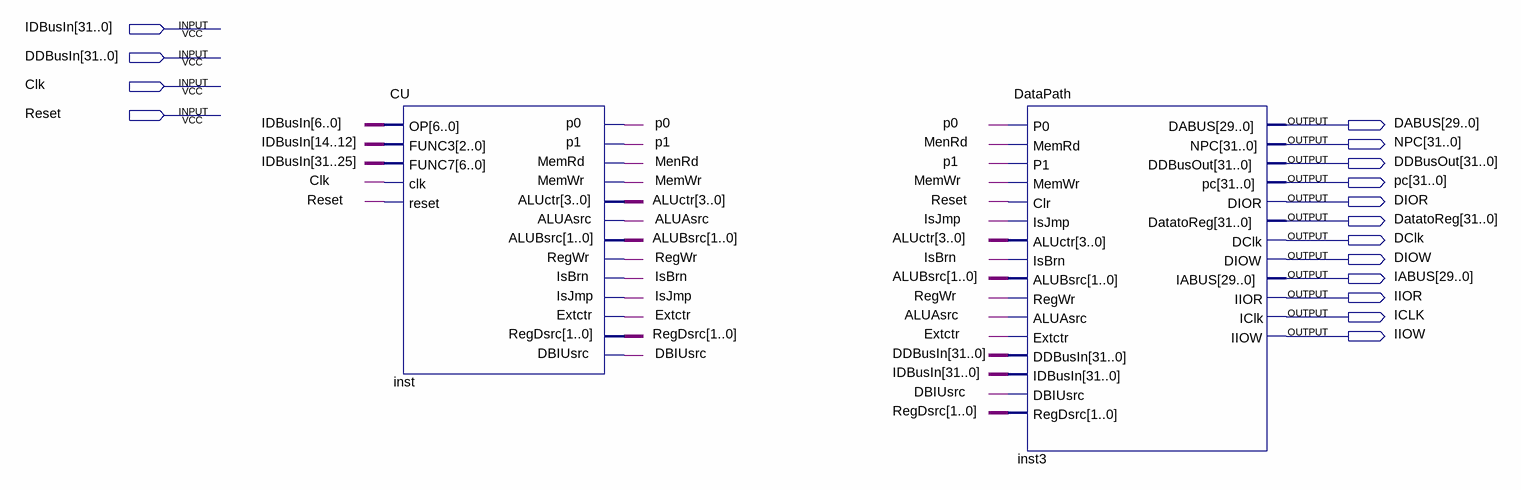
[diagram p0: schematic sheet]
// Quartus schematic CPU.bdf as structural Verilog: 2 symbols, 16 pins
module CPU (
  input  [31:0] IDBusIn,
  input  [31:0] DDBusIn,
  input  Clk,
  input  Reset,
  output [29:0] DABUS,
  output [31:0] NPC,
  output [31:0] DDBusOut,
  output [31:0] pc,
  output DIOR,
  output [31:0] DatatoReg,
  output DClk,
  output DIOW,
  output [29:0] IABUS,
  output IIOR,
  output ICLK,
  output IIOW
);

  wire ALUAsrc, DBIUsrc, Extctr, IsBrn, IsJmp, MemWr, MenRd, p0, p1, RegWr;
  wire [1:0] ALUBsrc, RegDsrc;
  wire [3:0] ALUctr;

  CU inst (
    .OP(IDBusIn[6:0]), .FUNC3(IDBusIn[14:12]), .FUNC7(IDBusIn[31:25]), .clk(Clk), .reset(Reset), .p0(p0),
    .p1(p1), .ALUAsrc(ALUAsrc), .ALUBsrc(ALUBsrc), .ALUctr(ALUctr), .RegDsrc(RegDsrc), .IsJmp(IsJmp),
    .IsBrn(IsBrn), .RegWr(RegWr), .Extctr(Extctr), .MemRd(MenRd), .MemWr(MemWr), .DBIUsrc(DBIUsrc));
  DataPath inst3 (
    .P0(p0), .MemRd(MenRd), .P1(p1), .MemWr(MemWr), .Clr(Reset), .IsJmp(IsJmp), .ALUctr(ALUctr),
    .IsBrn(IsBrn), .ALUBsrc(ALUBsrc), .RegWr(RegWr), .ALUAsrc(ALUAsrc), .Extctr(Extctr), .DDBusIn(DDBusIn),
    .IDBusIn(IDBusIn), .DBIUsrc(DBIUsrc), .RegDsrc(RegDsrc), .DABUS(DABUS), .NPC(NPC), .DDBusOut(DDBusOut),
    .pc(pc), .DIOR(DIOR), .DatatoReg(DatatoReg), .DClk(DClk), .DIOW(DIOW), .IABUS(IABUS), .IIOR(IIOR),
    .IClk(ICLK), .IIOW(IIOW));
endmodule
